# EAGLE design pomodoro-py32f002b (EAGLE 9.6.1)
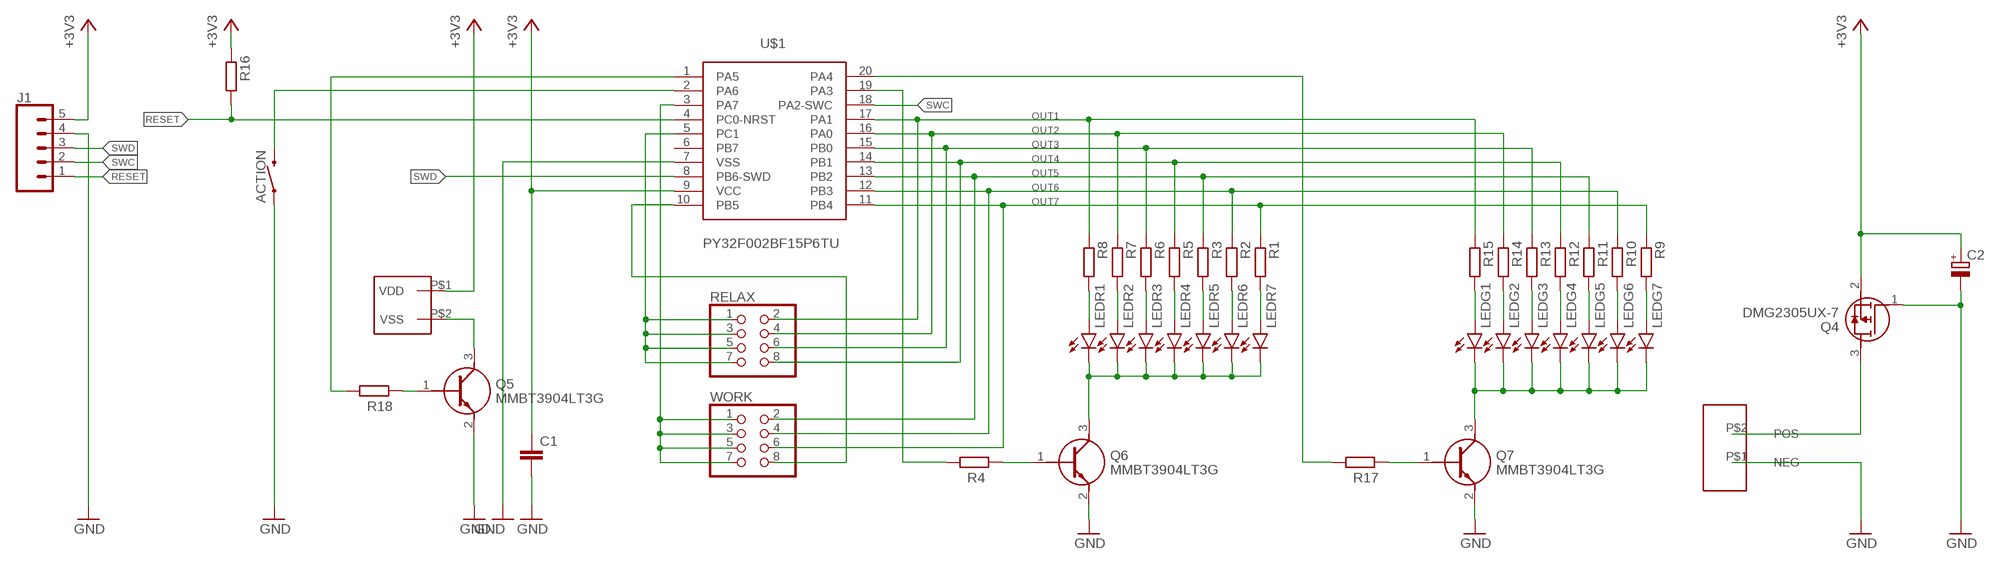
[diagram p0: schematic, sheet 1]

## Parts
ACTION  MOMENTARY-SWITCH-SPST-SMD-6.0X3.5MM  [TACTILE_SWITCH_SMD_6.0X3.5MM]
C1  C-EUC0805  [C0805]
C2  CPOL-EUE2.5-5  [E2,5-5]
J1  CONN_05  [1X05]
LEDG1  20ma  LED0603  [LED-0603]
LEDG2  20ma  LED0603  [LED-0603]
LEDG3  20ma  LED0603  [LED-0603]
LEDG4  20ma  LED0603  [LED-0603]
LEDG5  20ma  LED0603  [LED-0603]
LEDG6  20ma  LED0603  [LED-0603]
LEDG7  20ma  LED0603  [LED-0603]
LEDR1  20ma  LED0603  [LED-0603]
LEDR2  20ma  LED0603  [LED-0603]
LEDR3  20ma  LED0603  [LED-0603]
LEDR4  20ma  LED0603  [LED-0603]
LEDR5  20ma  LED0603  [LED-0603]
LEDR6  20ma  LED0603  [LED-0603]
LEDR7  20ma  LED0603  [LED-0603]
Q4  DMG2305UX-7  [SOT96P240X115-3N]
Q5  MMBT3904LT3G  [SOT96P237X111-3N]
Q6  MMBT3904LT3G  [SOT96P237X111-3N]
Q7  MMBT3904LT3G  [SOT96P237X111-3N]
R1  100R  R-EU_R0805  [R0805]
R2  100R  R-EU_R0805  [R0805]
R3  100R  R-EU_R0805  [R0805]
R4  10k  R-EU_R0805  [R0805]
R5  100R  R-EU_R0805  [R0805]
R6  100R  R-EU_R0805  [R0805]
R7  100R  R-EU_R0805  [R0805]
R8  100R  R-EU_R0805  [R0805]
R9  100R  R-EU_R0805  [R0805]
R10  100R  R-EU_R0805  [R0805]
R11  100R  R-EU_R0805  [R0805]
R12  100R  R-EU_R0805  [R0805]
R13  100R  R-EU_R0805  [R0805]
R14  100R  R-EU_R0805  [R0805]
R15  100R  R-EU_R0805  [R0805]
R16  100R  R-EU_R0805  [R0805]
R17  10K  R-EU_R0805  [R0805]
R18  10k  R-EU_R0805  [R0805]
RELAX  PINHD-2X4  [2X04]
U$1  PY32F002BF15P6TU  [TSSOP20]
U$2  BUZZER8X8  [BUZZER8X8]
U$3  2AAABATT  [2AAABATTSER]
WORK  PINHD-2X4  [2X04]

## Nets
+3V3: C1.1 C2.+ J1.5 Q4.2(S) R16.1 U$1.9(VCC) U$2.P$1(VDD)
BIN: R4.1 U$1.19(PA3)
BIN1: R17.1 U$1.20(PA4)
GND: ACTION.1 C1.2 C2.- J1.4 Q4.1(G) Q5.2(E) Q6.2(E) Q7.2(E) U$1.7(VSS) U$3.P$1(NEG)
LEDR1: LEDR1.A R8.2
N$1: LEDG7.A R9.2
N$2: LEDG6.A R10.2
N$3: LEDG5.A R11.2
N$4: LEDG4.A R12.2
N$5: LEDG3.A R13.2
N$6: Q7.1(B) R17.2
N$7: LEDG2.A R14.2
N$8: LEDG1.A R15.2
N$9: LEDR7.A R1.2
N$10: LEDG1.C LEDG2.C LEDG3.C LEDG4.C LEDG5.C LEDG6.C LEDG7.C Q7.3(C)
N$11: LEDR6.A R2.2
N$12: LEDR5.A R3.2
N$13: LEDR4.A R5.2
N$14: LEDR3.A R6.2
N$15: LEDR2.A R7.2
N$16: Q6.1(B) R4.2
N$17: Q5.3(C) U$2.P$2(VSS)
N$18: ACTION.2 U$1.2(PA6)
N$19: Q5.1(B) R18.2
N$26: R18.1 U$1.1(PA5)
N$28: U$1.3(PA7) WORK.1 WORK.3 WORK.5 WORK.7
N$31: RELAX.1 RELAX.3 RELAX.5 RELAX.7 U$1.5(PC1)
N$40: LEDR1.C LEDR2.C LEDR3.C LEDR4.C LEDR5.C LEDR6.C LEDR7.C Q6.3(C)
N$41: Q4.3(D) U$3.P$2(POS)
OUT1: R8.1 R15.1 RELAX.2 U$1.17(PA1)
OUT2: R7.1 R14.1 RELAX.4 U$1.16(PA0)
OUT3: R6.1 R13.1 RELAX.6 U$1.15(PB0)
OUT4: R5.1 R12.1 RELAX.8 U$1.14(PB1)
OUT5: R3.1 R11.1 U$1.13(PB2) WORK.2
OUT6: R2.1 R10.1 U$1.12(PB3) WORK.4
OUT7: R1.1 R9.1 U$1.11(PB4) WORK.6
OUT8: U$1.10(PB5) WORK.8
RESET: J1.1 R16.2 U$1.4(PC0-NRST)
SWC: J1.2 U$1.18(PA2-SWC)
SWD: J1.3 U$1.8(PB6-SWD)
Unconnected: U$1.6(PB7)

## Library data of the parts
ACTION = SparkFun-Switches:MOMENTARY-SWITCH-SPST: Momentary Switch (Pushbutton) - SPST Normally-open (NO) SPST momentary switches (buttons, pushbuttons). Variants PTH-12MM - 12mm square, through-hole Momentary Pushbutton Switch - 12mm Square <https://www.sparkfun.com/products/9190> (COM-09190) PTH-6.0MM, PTH-6.0MM-KIT - 6.0mm square, through-hole Mini Pushbutton Switch <https://www.sparkfun.com/products/97> (COM-00097) KIT package intended for soldering kit's - only one side of pads' copper is exposed. PTH-RIGHT-ANGLE-KIT - Right-angle, through-hole Right Angle Tactile Button <https://www.sparkfun.com/products/10791> - Used on SparkFun BigTime Watch Kit <https://www.sparkfun.com/products/11734> SMD-12MM - 12mm square, surface-mount Tactile Button - SMD (12mm) <https://www.sparkfun.com/products/12993> (COM-12993) Used on SparkFun PicoBoard <https://www.sparkfun.com/products/11888> SMD-4.5MM - 4.5mm Square Trackball Switch Used on SparkFun Blackberry Trackballer Breakout <https://www.sparkfun.com/products/13169> SMD-4.6MMX2.8MM - 4.60mm x 2.80mm, surface mount Used on SparkFun SAMD21 Mini Breakout <https://www.sparkfun.com/products/13664> SMD-5.2MM, SMD-5.2-REDUNDANT - 5.2mm square, surface-mount Mini Pushbutton Switch - SMD <https://www.sparkfun.com/products/8720> (COM-08720) Used on Arduino Pro Mini <https://www.sparkfun.com/products/11114> REDUNDANT package connects both switch circuits together SMD-6.0X3.5MM - 6.0 x 3.5mm, surface mount Momentary Reset Switch SMD <https://www.sparkfun.com/products/8229> (COM-08229) SMD-6.2MM-TALL - 6.2mm square, surface mount Tactile Button - SMD (6mm) <https://www.sparkfun.com/products/12992> Used on SparkFun Digital Sandbox <https://www.sparkfun.com/products/12651> SMD-RIGHT-ANGLE - Right-angle, surface mount Used on SparkFun Block for Intel® Edison - Arduino <https://www.sparkfun.com/products/13036>; PROD_ID: SWCH-14278; SF_SKU: COM-08229
C1 = rcl:C-EU: CAPACITOR, European symbol; SPICEPREFIX: C
C2 = rcl:CPOL-EU: POLARIZED CAPACITOR, European symbol; SPICEPREFIX: C
J1 = SparkFun-Connectors:CONN_05: Multi connection point. Often used as Generic Header-pin footprint for 0.1 inch spaced/style header connections On any of the 0.1 inch spaced packages, you can populate with these: Break Away Headers - Straight <https://www.sparkfun.com/products/116> (PRT-00116) Break Away Male Headers - Right Angle <https://www.sparkfun.com/products/553> (PRT-00553) Female Headers <https://www.sparkfun.com/products/115> (PRT-00115) Break Away Headers - Machine Pin <https://www.sparkfun.com/products/117> (PRT-00117) Break Away Female Headers - Swiss Machine Pin <https://www.sparkfun.com/products/743> (PRT-00743) For SCREWTERMINALS and SPRING TERMINALS visit here: Screw Terimnals on SparkFun.com <https://www.sparkfun.com/search/results?term=Screw+Terminals> (5mm/3.5mm/2.54mm spacing) This device is also useful as a general connection point to wire up your design to another part of your project. Our various solder wires solder well into these plated through hole pads. Hook-Up Wire - Assortment (Stranded, 22 AWG) <https://www.sparkfun.com/products/11375> (PRT-11375) Hook-Up Wire - Assortment (Solid Core, 22 AWG) <https://www.sparkfun.com/products/11367> (PRT-11367) View the entire wire category on our website here <https://www.sparkfun.com/categories/141> Special notes: Molex polarized connector foot print use with SKU : PRT-08231 with associated crimp pins and housings. 1MM SMD Version SKU: PRT-10208
LEDG1-LEDG7 LEDR1-LEDR7 = SparkFun-LED:LED: LED (Generic) Standard schematic elements and footprints for 5mm, 3mm, 1206, and 0603 sized LEDs. Generic LEDs with no color specified.
Q4 = DMG2305UX-7:DMG2305UX-7: MOSFET P-Ch 20V 5A Enhancement SOT23 Diodes Inc DMG2305UX-7 P-channel MOSFET Transistor, -3.3 A, -20 V, 3-Pin SOT-23 Source: Datasheet <https://www.diodes.com//assets/Datasheets/DMG2305UX.pdf>; DESCRIPTION: MOSFET P-Ch 20V 5A Enhancement SOT23 Diodes Inc DMG2305UX-7 P-channel MOSFET Transistor, -3.3 A, -20 V, 3-Pin SOT-23; HEIGHT: 1.15mm; MANUFACTURER_NAME: Diodes Incorporated; MANUFACTURER_PART_NUMBER: DMG2305UX-7; MOUSER_PART_NUMBER: 621-DMG2305UX-7; MOUSER_PRICE-STOCK: https://www.mouser.co.uk/ProductDetail/Diodes-Incorporated/DMG2305UX-7?qs=L1DZKBg7t5F%2FNBHrjfxC%252Bg%3D%3D
Q5-Q7 = MMBT3904LT3G:MMBT3904LT3G: Transistor NPN 40V 200mA SOT-23 ON Semi MMBT3904LT3G NPN Bipolar Transistor, 900 mA 40 V, 3-Pin SOT-23 Source: Datasheet <http://www.onsemi.com/pub/Collateral/MMBT3904LT1-D.PDF>; DESCRIPTION: Transistor NPN 40V 200mA SOT-23 ON Semi MMBT3904LT3G NPN Bipolar Transistor, 900 mA 40 V, 3-Pin SOT-23; HEIGHT: 1.11mm; MANUFACTURER_NAME: onsemi; MANUFACTURER_PART_NUMBER: MMBT3904LT3G; MOUSER_PART_NUMBER: 863-MMBT3904LT3G; MOUSER_PRICE-STOCK: https://www.mouser.co.uk/ProductDetail/onsemi/MMBT3904LT3G?qs=HVbQlW5zcXUpjKhCMxE5QQ%3D%3D
R1-R18 = rcl:R-EU_: RESISTOR, European symbol; SPICEPREFIX: R
RELAX WORK = pinhead:PINHD-2X4: PIN HEADER
U$1 = angelo-PY32F002BF15P6TU:PY32F002BF15P6TU
U$2 = buzzer:BUZZER8X8
U$3 = 2aaabatt:2AAABATT

## Net classes
0 default: width 0.152 mm, drill 0.152 mm, clearance 0.152 mm
1 logic: width 0.152 mm, drill 0.254 mm, clearance 0.152 mm

## Board
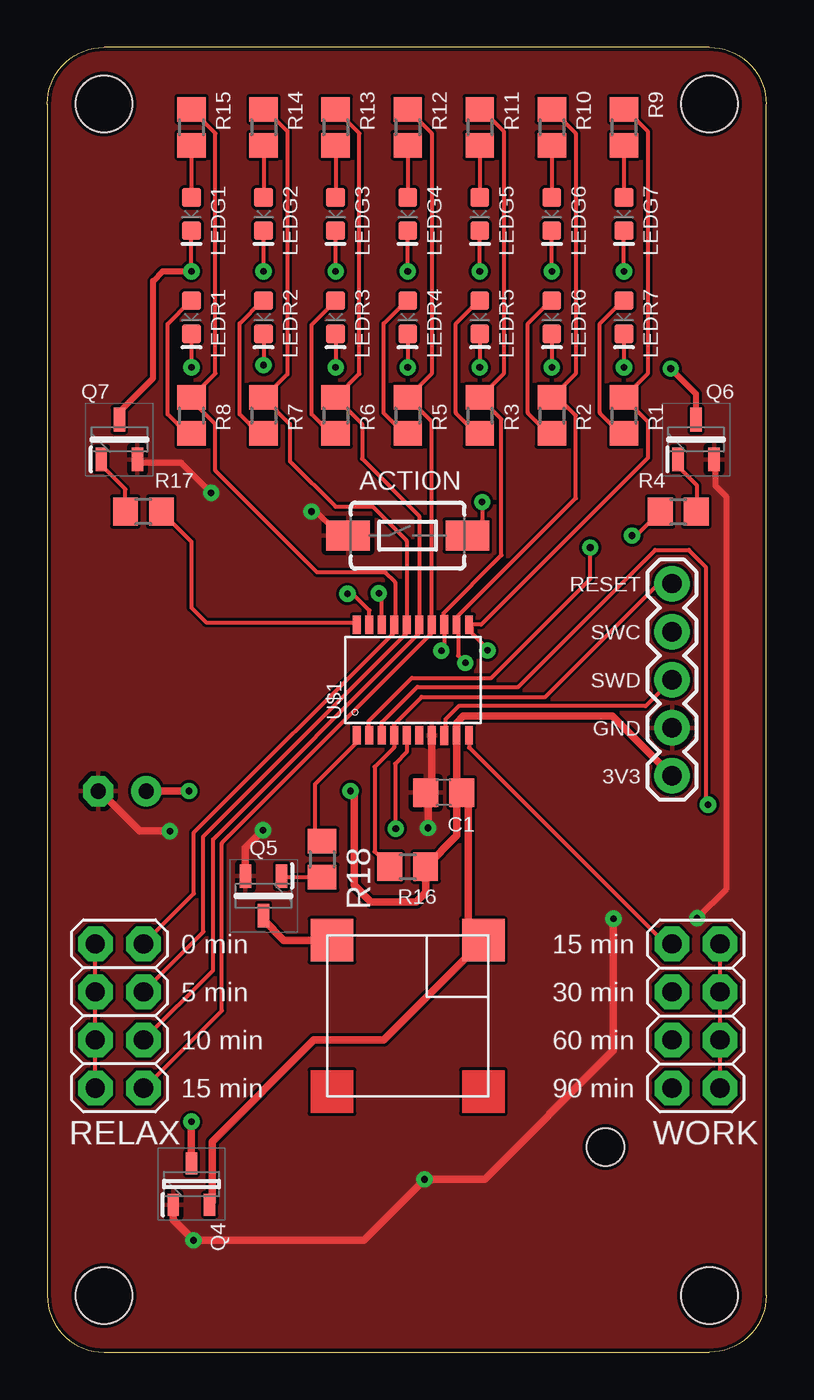
[diagram p1: board, top side]
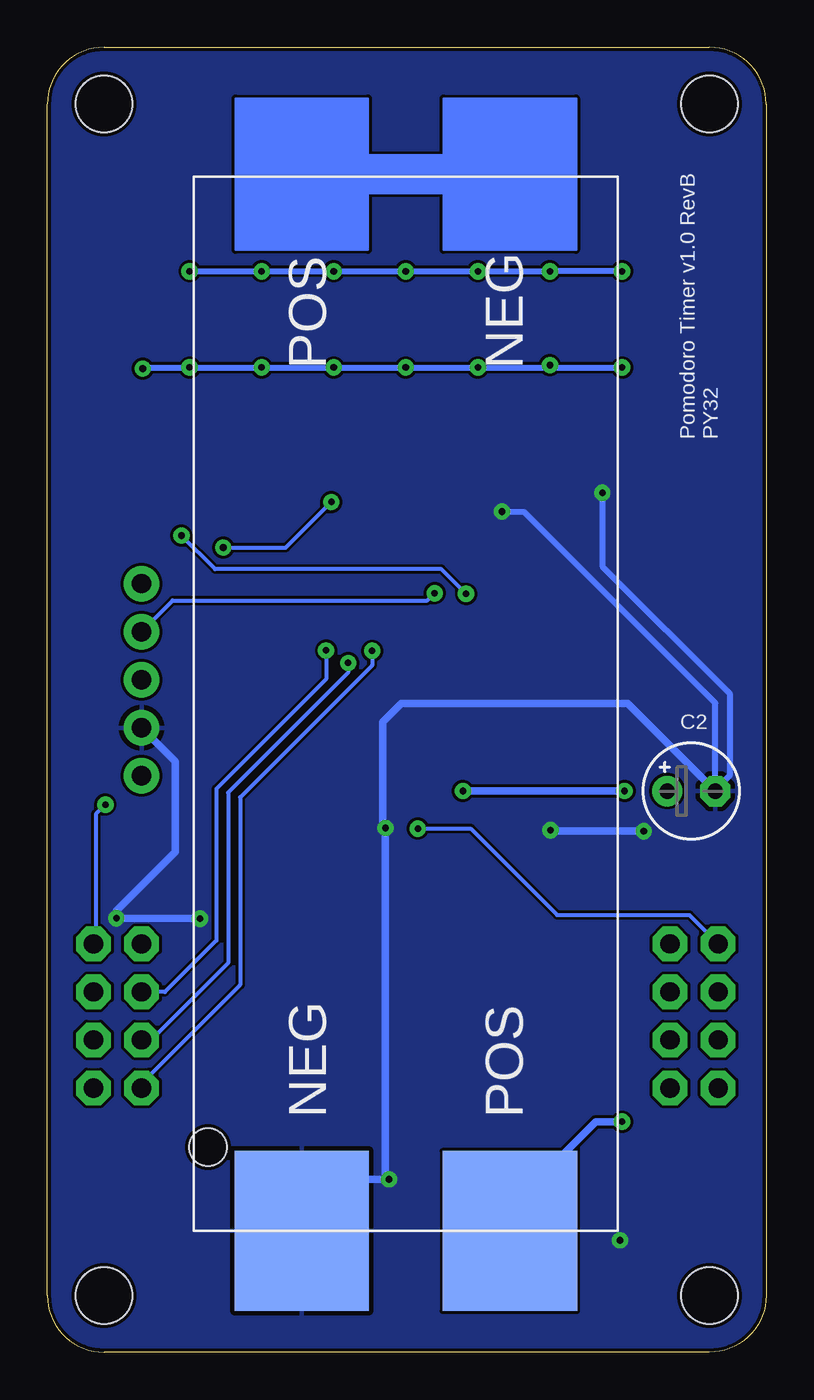
[diagram p2: board, bottom side, seen from below]

Size 38 x 69 mm. Coordinates in mm from the lower left corner, seen from the top.
Outline: 3,0 35,0 arc90 38,3 38,66 arc90 35,69 3,69 arc90 0,66 0,3 arc90 3,0
Copper layers (1*16): Top 0.035mm / dielectric 1.6mm / Bottom 0.035mm
Design rules "angelo-jlcpcb-2layers": minimum track width 8mil, minimum drill 0.3mm, track to track 6mil, track to pad 6mil, pad to pad 6mil, via to via 10mil, smd to smd 6mil, copper to edge 0.2mm, drill to drill 8mil, minimum pad ring 10mil, minimum via ring 10mil, stop-mask expansion 4mil, vias tented up to drill 0mil, thermal gap 10mil
Holes 3 mm at 3,66 35,66 3,3 35,3

### Footprints (pad centres in the part's own frame; a part is rotated, then mirrored left to right if it is on the bottom)
TACTILE_SWITCH_SMD_6.0X3.5MM = smd 2.3 x 1.6: 1 -3.15,0; 2 3.15,0
C0805 = smd 1.3 x 1.5: 1 -0.95,0; 2 0.95,0
E2,5-5 = drill 0.813 pad 1.6: + -1.27,0 | drill 0.813 pad 1.6 octagon: - 1.27,0
1X05 = drill 1.016 pad 1.88: 1 0,0; 2 2.54,0; 3 5.08,0; 4 7.62,0; 5 10.16,0
LED-0603 = smd 1 x 1: A -0.877,0; C 0.877,0
SOT96P240X115-3N = smd 1.15 x 0.6: 1 -1.1,0.96; 2 -1.1,-0.96; 3 1.1,0
SOT96P237X111-3N = smd 1.25 x 0.6: 1 -1.05,0.955; 2 -1.05,-0.955; 3 1.05,0
R0805 = smd 1.3 x 1.5: 1 -0.95,0; 2 0.95,0
2X04 = drill 1.016 octagon: 1 -3.81,-1.27; 2 -3.81,1.27; 3 -1.27,-1.27; 4 -1.27,1.27; 5 1.27,-1.27; 6 1.27,1.27; 7 3.81,-1.27; 8 3.81,1.27
TSSOP20 = smd 1 x 0.4: 1 -2.937,2.693; 2 -2.937,2.032; 3 -2.937,1.372; 4 -2.937,0.712; 5 -2.937,0.051; 6 -2.937,-0.609; 7 -2.937,-1.27; 8 -2.943,-1.93; 9 -2.937,-2.59; 10 -2.937,-3.251; 11 2.905,-3.251; 12 2.905,-2.59; 13 2.911,-1.93; 14 2.905,-1.27; 15 2.905,-0.609; 16 2.905,0.051; 17 2.905,0.712; 18 2.905,1.372; 19 2.905,2.032; 20 2.905,2.693
BUZZER8X8 = smd 2.25 x 2.25: P$1 4,-4; P$2 4,4
2AAABATTSER = smd 8.45 x 7.1: P$1 -27.875,5.5; P$2 -27.875,-5.5 | hole 2: -23.45,10.45

### Placement (x,y rotation side)
ACTION  19.05,43.18 0 top
C1  20.95,29.59 180 top
C2  3.96,29.67 0 bottom
J1  33.02,40.64 270 top
LEDG1  7.62,60.19 270 top
LEDG2  11.43,60.19 270 top
LEDG3  15.24,60.19 270 top
LEDG4  19.05,60.19 270 top
LEDG5  22.86,60.19 270 top
LEDG6  26.67,60.19 270 top
LEDG7  30.48,60.19 270 top
LEDR1  7.62,54.73 270 top
LEDR2  11.43,54.73 270 top
LEDR3  15.24,54.73 270 top
LEDR4  19.05,54.73 270 top
LEDR5  22.86,54.73 270 top
LEDR6  26.67,54.73 270 top
LEDR7  30.48,54.73 270 top
Q4  7.62,8.89 90 top
Q5  11.43,24.13 270 top
Q6  34.29,48.26 90 top
Q7  3.81,48.26 90 top
R1  30.48,49.53 270 top
R2  26.67,49.53 270 top
R3  22.86,49.53 270 top
R4  33.35,44.45 0 top
R5  19.05,49.53 270 top
R6  15.24,49.53 270 top
R7  11.43,49.53 270 top
R8  7.62,49.53 270 top
R9  30.48,64.77 270 top
R10  26.67,64.77 270 top
R11  22.86,64.77 270 top
R12  19.05,64.77 270 top
R13  15.24,64.77 270 top
R14  11.43,64.77 270 top
R15  7.62,64.77 270 top
R16  19.05,25.67 180 top
R17  5.08,44.45 180 top
R18  14.53,26.06 270 top
RELAX  3.81,17.78 270 top
U$1  19.05,35.56 90 top
U$2  19.05,17.78 90 top
U$3  19.05,34.29 90 bottom
WORK  34.29,17.78 90 top

### Tracks (layer width: path | path; a pad name or v marks a point on that pad's centre or on a via)
+3V3  (via drill 0.35)
  Top 0.305: C1.1 22.26,29.24 | 22.26,22.57 U$2.P$1
  Top 0.406: 22.26,29.24 22.26,22.57 | U$2.P$1 17.78,16.51 14.1,16.51 8.71,11.12 8.71,7.92 Q4.2 | J1.5 29.87,33.63 22,33.63 21.64,33.28 U$1.9 21.64,29.86 C1.1 21.65,29.34 21.65,27.32 R16.1 20,24.32 19.5,23.82 17.11,23.82 16.23,24.7 16.23,29.48 v16.03,29.68 | v7.49,29.68 5.25,29.68 C2.+
  Bottom 0.406: v16.03,29.68 v7.49,29.68
BIN  (via drill 0.35)
  Top 0.203: U$1.19 17.02,39.23 16.15,40.1 v15.87,40.1 | R4.1 31.13,43.18 v30.91,43.18
  Bottom 0.203: v15.87,40.1 17.17,41.4 29.13,41.4 v30.91,43.18
BIN1
  Top 0.203: U$1.20 16.23,38.59 8.4,38.59 7.62,39.37 7.62,42.86 R17.1
GND  (via drill 0.35)
  Top 0.203: v20.13,27.73 v20.13,27.72
  Top 0.305: 20.32,29.91 C1.2 | v34.35,22.95 35.88,24.48 35.88,45.25 35.32,45.81 35.32,47.14 Q6.2 | ACTION.1 15.65,43.43 15.24,43.43 14.22,44.45 v13.97,44.45 | C2.- 2.76,29.67 | v8.66,45.44 7.09,47.02 4.96,47.02 Q7.2
  Top 0.406: U$1.7 20.32,29.91 | C1.2 20.13,29.46 v20.13,27.73 | Q4.1 6.66,6.99 v7.73,5.92 16.71,5.92 v19.94,9.14 23.11,9.14 29.93,15.96 v29.93,22.93 | v6.48,27.55 4.88,27.55 2.76,29.67 | Q5.2 10.47,26.68 v11.4,27.6
  Bottom 0.305: 34.35,23.33 v34.35,22.95 34.33,22.94 | v20.13,27.72 20.27,27.86 | v13.97,44.45 12.83,44.45 2.69,34.31 C2.- | v29.93,22.93 v29.94,22.94 | v8.66,45.44 8.66,41.55 1.91,34.8 1.91,30.52 2.69,29.74
  Bottom 0.406: U$3.P$1 21.82,9.14 v19.94,9.14 20.13,9.33 v20.13,27.72 | 34.35,23.33 31.24,26.44 31.24,31.24 J1.4 | 20.27,27.86 20.27,33.33 19.3,34.29 7.32,34.29 C2.- 2.69,29.74 | v11.4,27.6 11.35,27.55 v6.48,27.55 | 34.33,22.94 v29.94,22.94
  pour Top: 0,0 0,69 38,69 38,0
  pour Bottom: 0,0 38,0 38,69 0,69
LEDR1
  Top 0.203: R8.2 7.38,48.58 6.36,49.6 6.36,54.37 7.59,55.6 LEDR1.A
N$1
  Top 0.203: R9.2 LEDG7.A
N$2
  Top 0.203: R10.2 LEDG6.A
N$3
  Top 0.203: R11.2 LEDG5.A
N$4
  Top 0.203: R12.2 LEDG4.A
N$5
  Top 0.203: R13.2 LEDG3.A
N$6
  Top 0.203: R17.2 4.13,45.63 2.85,46.91 Q7.1
N$7
  Top 0.203: R14.2 LEDG2.A
N$8
  Top 0.203: R15.2 LEDG1.A
N$9
  Top 0.203: R1.2 30.29,48.58 29.21,49.66 29.21,54.39 30.42,55.6 LEDR7.A
N$10  (via drill 0.35)
  Top 0.203: v7.62,57.15 LEDG1.C | v11.43,57.15 LEDG2.C | v15.24,57.15 LEDG3.C | v19.05,57.15 LEDG4.C | v22.86,57.15 LEDG5.C | v26.67,57.15 LEDG6.C | v30.48,57.15 LEDG7.C
  Top 0.305: Q7.3 3.81,49.72 5.59,51.49 5.59,56.64 6.1,57.15 v7.62,57.15
  Bottom 0.305: v7.62,57.15 v11.43,57.15 v15.24,57.15 v19.05,57.15 v22.86,57.15 v26.67,57.15 v30.48,57.15
N$11
  Top 0.203: R2.2 26.48,48.58 25.4,49.66 25.4,54.39 26.61,55.6 LEDR6.A
N$12
  Top 0.203: R3.2 22.67,48.58 21.59,49.66 21.59,54.39 22.8,55.6 LEDR5.A
N$13
  Top 0.203: R5.2 18.86,48.58 17.78,49.66 17.78,54.39 18.99,55.6 LEDR4.A
N$14
  Top 0.203: R6.2 14.99,48.58 13.97,49.6 13.97,54.33 LEDR3.A
N$15
  Top 0.203: R7.2 11.18,48.58 10.16,49.6 10.16,54.39 11.37,55.6 LEDR2.A
N$16
  Top 0.203: Q6.1 33.34,46.85 34.33,45.86 34.33,44.48 R4.2
N$17
  Top 0.406: U$2.P$2 12.51,21.78 11.43,22.86 Q5.3
N$18  (via drill 0.35)
  Top 0.203: U$1.2 16.97,32.67 16.97,33.35 19.28,35.66 23.47,35.66 28.7,40.89 v28.7,42.55 | v22.99,44.96 22.99,43.97 ACTION.2
  Bottom 0.203: v28.7,42.55 25.4,42.55 v22.99,44.96
N$19
  Top 0.203: R18.2 12.46,25.11 Q5.1
N$26
  Top 0.203: U$1.1 16.36,32.24 14.16,30.04 14.16,27.38 R18.1
N$28  (via drill 0.35)
  Top 0.203: WORK.1 WORK.3 WORK.5 WORK.7 | U$1.3 17.68,33.3 19.56,35.18 24.89,35.18 32.13,42.42 33.91,42.42 34.8,41.53 34.8,29.08 v34.92,28.96
  Bottom 0.203: v34.92,28.96 35.43,28.45 35.43,21.72 WORK.7
N$31  (via drill 0.35)
  Top 0.203: RELAX.7 RELAX.5 RELAX.3 RELAX.1 | U$1.5 19,31.73 18.38,31.11 18.38,27.72 v18.41,27.69
  Bottom 0.203: v18.41,27.69 15.62,27.69 11.05,23.11 4.06,23.11 RELAX.1
N$40  (via drill 0.35)
  Top 0.203: LEDR1.C v7.62,52.07 | LEDR2.C v11.43,52.2 | LEDR3.C v15.24,52.07 | LEDR4.C v19.05,52.07 | LEDR5.C v22.86,52.07 | LEDR6.C v26.67,52.07 | LEDR7.C v30.48,52.07
  Top 0.305: v32.96,52.01 34.29,50.67 Q6.3
  Bottom 0.203: v32.96,52.01 32.96,52.07 | 11.56,52.07 v11.43,52.2 11.3,52.07
  Bottom 0.305: 32.96,52.07 v30.48,52.07 v26.67,52.07 v22.86,52.07 v19.05,52.07 v15.24,52.07 11.56,52.07 | 11.3,52.07 v7.62,52.07
N$41  (via drill 0.35)
  Top 0.406: v7.62,12.19 Q4.3
  Bottom 0.406: U$3.P$2 13.55,7.66 9.02,12.19 v7.62,12.19
OUT1
  Top 0.203: R15.1 8.89,64.45 8.89,51.75 R8.1 7.62,50.34 8.88,49.08 8.88,46.62 14.26,41.24 17.87,41.24 18.39,40.72 18.39,38.51 U$1.17 18.39,38.42 18.39,38.11 7.75,27.48 7.75,24.26 RELAX.2
OUT2
  Top 0.203: R14.1 11.54,65.72 12.69,64.58 12.69,51.71 11.46,50.48 R7.1 12.83,49.08 12.83,47.12 15.24,44.7 17.21,44.7 19,42.91 U$1.16 19,38.02 8.26,27.28 8.26,22.23 RELAX.4
OUT3
  Top 0.203: R13.1 15.24,65.71 16.5,64.45 16.5,51.74 R6.1 16.64,49.08 16.64,47.24 19.66,44.22 U$1.15 19.66,38.02 8.76,27.12 8.76,20.19 RELAX.6
OUT4
  Top 0.203: R12.1 19.05,65.71 20.31,64.45 20.31,51.74 R5.1 20.32,49.21 U$1.14 20.32,38.02 9.23,26.93 9.23,18.05 5.15,13.97 RELAX.8
OUT5  (via drill 0.35)
  Top 0.203: R11.1 22.97,65.72 24.12,64.58 24.12,51.74 R3.1 24,49.34 24,42.14 20.93,39.07 20.93,38.52 U$1.13 20.98,37.24 v20.83,37.08
  Bottom 0.203: v20.83,37.08 20.83,36.32 27.81,29.34 27.81,19.43 33.02,14.22 WORK.2
OUT6  (via drill 0.35)
  Top 0.203: R10.1 26.67,65.71 27.93,64.45 27.93,51.74 R2.1 26.99,50.48 27.94,49.53 27.94,45.16 21.59,38.82 21.59,38.51 U$1.12 21.72,38.39 21.72,36.83 v22.1,36.45
  Bottom 0.203: v22.1,36.45 22.1,35.94 28.45,29.59 28.45,20.57 32.51,16.51 WORK.4
OUT7  (via drill 0.35)
  Top 0.203: R9.1 30.59,65.72 31.74,64.58 31.74,51.74 R1.1 31.75,49.21 31.75,47.28 22.94,38.47 U$1.11 22.43,38.34 22.43,38.04 23.26,37.2 v23.26,37.11
  Bottom 0.203: v23.26,37.11 23.26,35.59 29.06,29.79 29.06,21.77 31.78,19.05 WORK.6
OUT8
  Top 0.203: U$1.10 22.3,31.97 32.69,21.59 WORK.8
RESET
  Top 0.203: J1.1 32.31,40.64 26.32,34.66 19.79,34.66 18.34,33.2 U$1.4 18.34,31.99 17.3,30.95 17.3,26.47 R16.2
SWC  (via drill 0.35)
  Top 0.203: U$1.18 17.68,39.98 v17.53,40.13
  Bottom 0.203: v17.53,40.13 17.91,39.75 31.37,39.75 J1.2
SWD
  Top 0.203: U$1.8 21.06,32.7 21.06,33.48 21.74,34.16 31.62,34.16 J1.3

### Text on the board
tNames: RESET | SWC | SWD | GND | 3V3 | 15 min | 0 min | 30 min | 5 min | 60 min | 10 min | 90 min | 15 min
bNames: Pomodoro Timer v1.0 RevB / PY32